# EAGLE design 716_breakout_i2c (EAGLE 9.1.1)
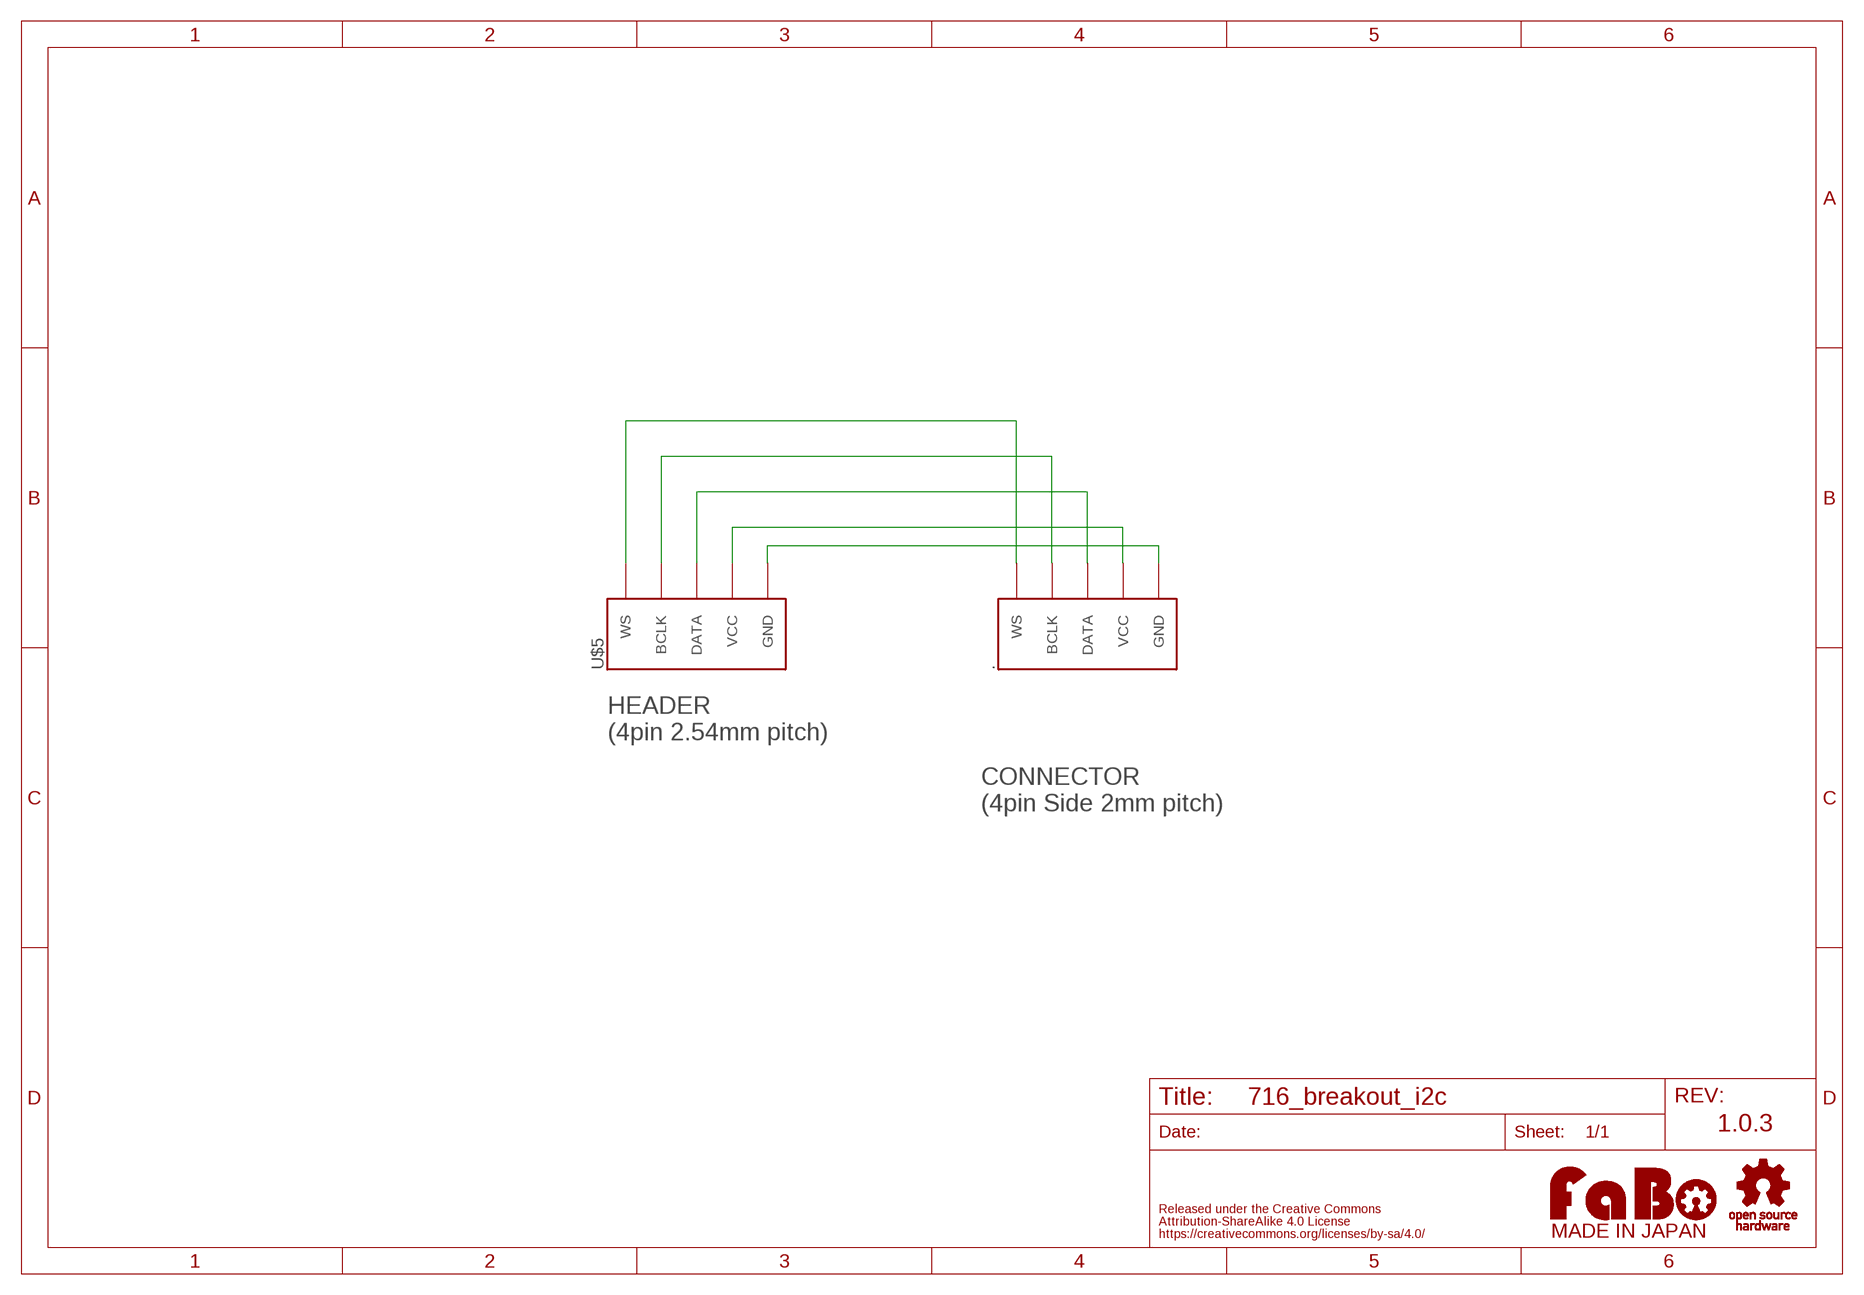
[diagram p0: schematic, sheet 1]

## Parts
.  FABO_BRICK_I2SLONG  [FABO_BRICK_I2S_S05B-PASK-2_LONG]
U$2  LOGO_FABO-M_BOTTOM  [LOGO_FABO_MS_BOTTOM]
U$3  LOGO_OSHW-S_BOTTOM  [LOGO_OSHW_S_BOTTOM]
U$5  FABO_BRICK_I2S-BREAKOUT  [FABO_BRICK_I2S_BREAKOUT]

## Nets
BCLK: ..BCLK U$5.BCLK
DATA: ..DATA U$5.DATA
GND: ..GND U$5.GND
VCC: ..VCC U$5.VCC
WS: ..WS U$5.WS

## Notes on the sheet
- HEADER
  (4pin 2.54mm pitch)
- CONNECTOR
  (4pin Side 2mm pitch)
- 1.0.3

## Library data of the parts
. U$5 = FaBo-Template:FABO_BRICK_I2S
U$2 = FaBo-etc:LOGO_FABO
U$3 = FaBo-etc:LOGO_OSHW

## Board
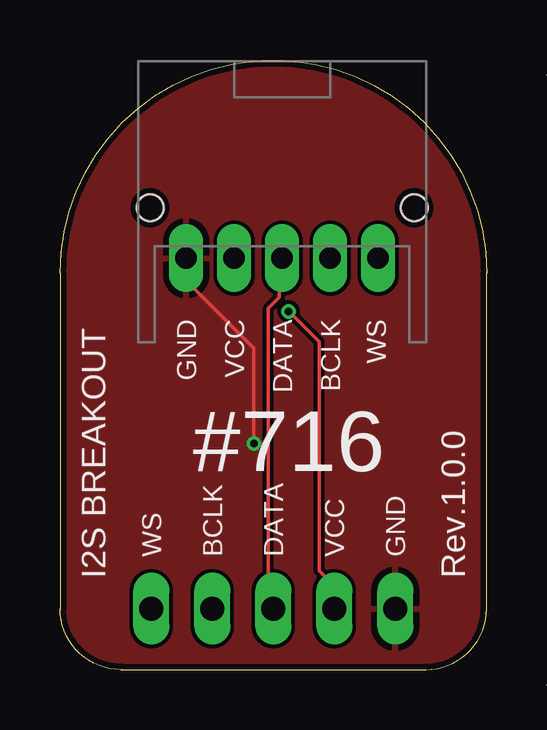
[diagram p1: board, top side]
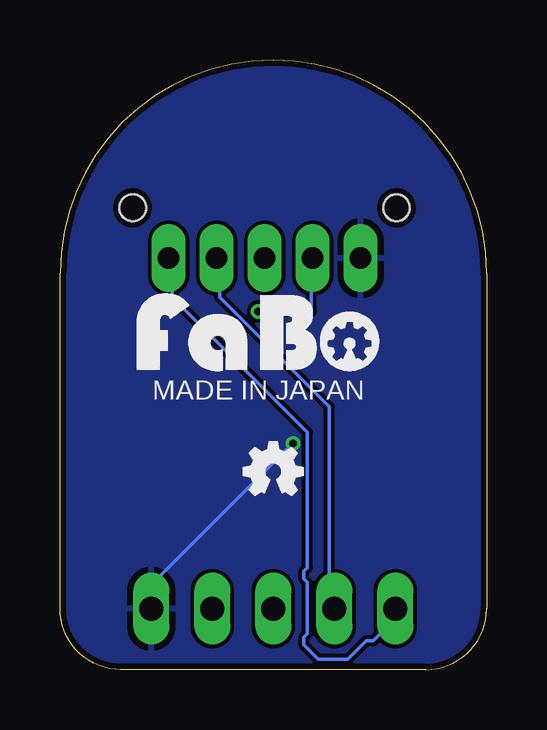
[diagram p2: board, bottom side, seen from below]

Size 17.78 x 25.4 mm. Coordinates in mm from the lower left corner, seen from the top.
Copper layers (1*16): Top 0.035mm / dielectric 1.5mm / Bottom 0.035mm
Design rules "SeeedStudio_2layer_DRU_no_angle_20140221": minimum track width 6mil, minimum drill 12mil, track to track 6mil, track to pad 6mil, pad to pad 6mil, via to via 6mil, smd to smd 0mil, copper to edge 10mil, drill to drill 10mil, minimum pad ring 10mil, minimum via ring 6mil, stop-mask expansion 2mil, vias tented up to drill 100mil, thermal gap 10mil

### Footprints (pad centres in the part's own frame; a part is rotated, then mirrored left to right if it is on the bottom)
FABO_BRICK_I2S_S05B-PASK-2_LONG = drill 0.9 pad 1.422 long: BCLK 3,0; DATA 1,0; GND -3,0; VCC -1,0; WS 5,0 | hole 1.1: 6.5,2.1; -4.5,2.1
FABO_BRICK_I2S_BREAKOUT = drill 1 long: BCLK -2.54,-8.89; DATA 0,-8.89; GND 5.08,-8.89; VCC 2.54,-8.89; WS -5.08,-8.89

### Placement (x,y rotation side)
.  8.26,17.15 0 top
U$2  9.53,12.06 0 top
U$3  8.89,8.26 0 top
U$5  8.89,11.43 0 top

### Tracks (layer width: path | path; a pad name or v marks a point on that pad's centre or on a via)
BCLK
  Bottom 0.152: ..BCLK 11.12,17.04 11.12,15.52 6.55,10.95 6.55,2.72 6.4,2.57 U$5.BCLK
DATA
  Top 0.152: ..DATA 9.14,17.04 9.14,15.52 8.69,15.06 8.69,2.72 8.84,2.57 U$5.DATA
GND  (via drill 0.3)
  Top 0.152: v8.08,9.42 8.08,13.39 5.33,16.13 5.33,17.04 ..GND
  Bottom 0.152: v8.08,9.42 13.87,3.63 13.87,2.57 U$5.GND
  pour Top: 0,-0.63 0,25.4 17.78,25.4 17.78,-0.63
  pour Bottom: 0,-0.63 0,25.4 17.78,25.4 17.78,-0.63
VCC  (via drill 0.3)
  Top 0.152: v9.53,14.92 10.79,13.65 10.79,4.13 11.43,3.49 U$5.VCC
  Bottom 0.152: v9.53,14.92 7.3,14.92 7.3,17.15 ..VCC
WS
  Bottom 0.152: ..WS 13.11,17.04 13.11,15.52 7.47,9.88 7.47,4.24 7.62,4.09 7.62,3.79 7.47,3.63 7.47,1.5 7.62,1.35 7.62,1.04 7.01,0.43 5.79,0.43 5.03,1.19 4.72,1.19 3.81,2.11 3.81,2.41 U$5.WS

### Text on the board
tPlace: GND | VCC | DATA | BCLK | WS | #716 | I2S BREAKOUT | Rev.1.0.0
bPlace: MADE IN JAPAN